# Altium schematic sheet sheet2_sensors.SchDoc
size A4
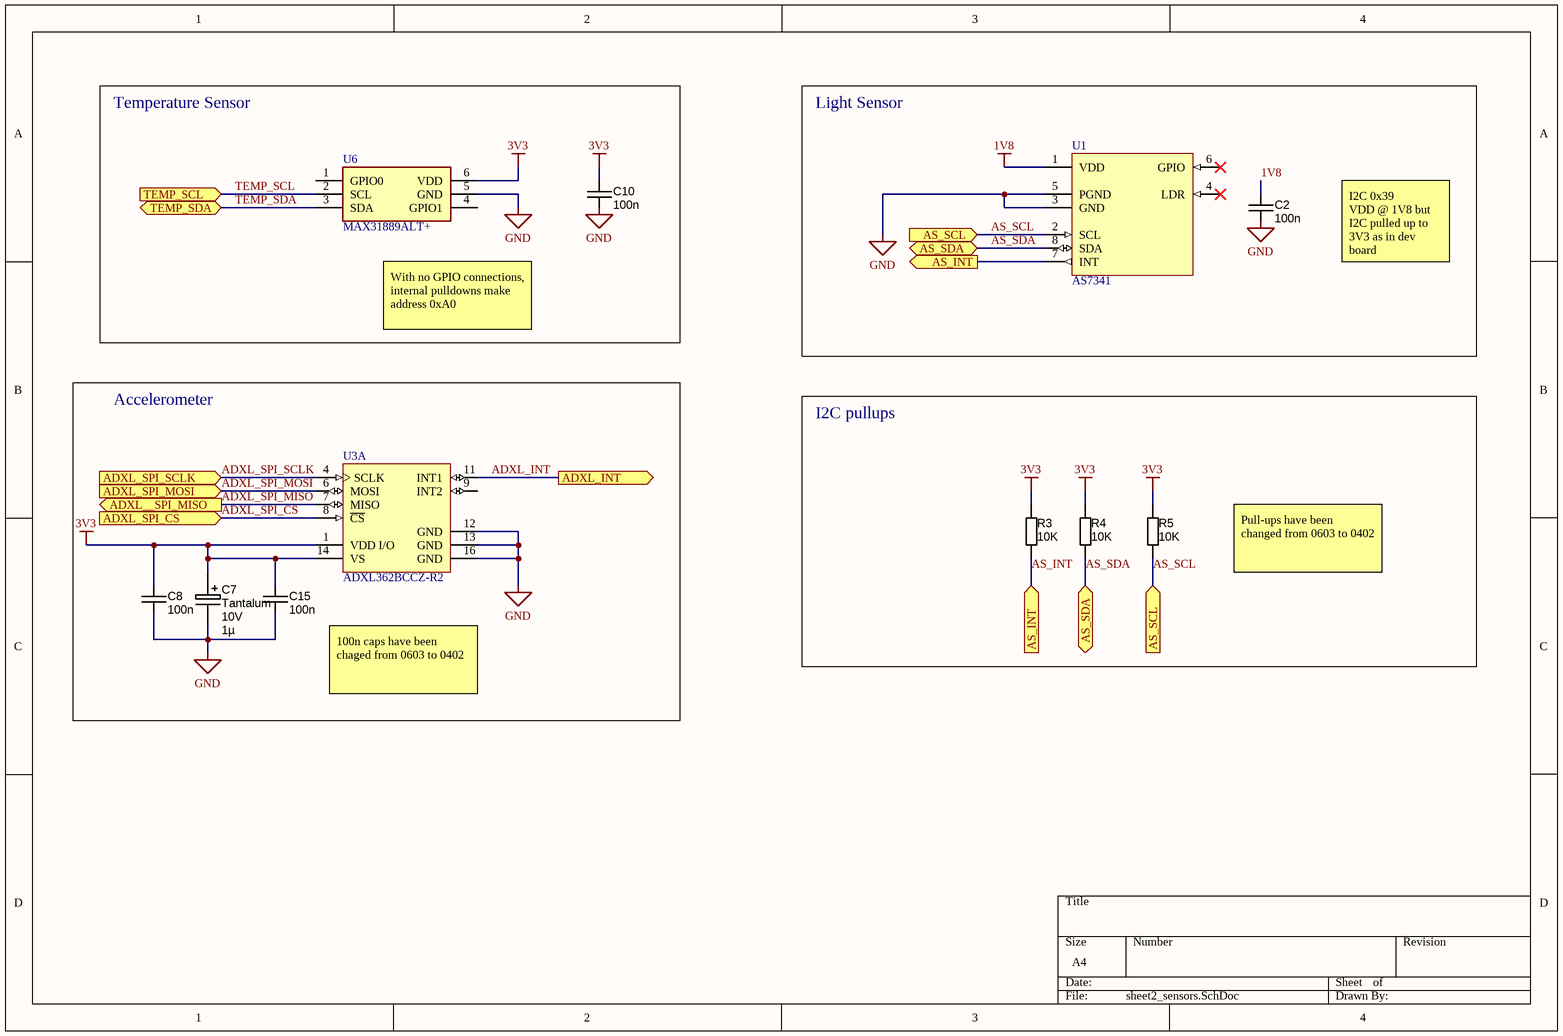
[diagram p0: sheet2_sensors.SchDoc]

## Parts
C2  100n  [CAPC1005X55N]
C7  Material: Tantalum  Ratings: 10V  [CAPMP2012X150USR]  (hidden comment: 1µ)
C8  100n  [CAPC1005X55N]
C10  100n  [CAPC1005X55N]
C15  100n  [CAPC1005X55N]
R3  value 10K  [RESC1005X40N]  (hidden comment: Thick Film)
R4  value 10K  [RESC1005X40N]  (hidden comment: Thick Film)
R5  value 10K  [RESC1005X40N]  (hidden comment: Thick Film)
U1  AS7341  [OLGA8]
U3  ADXL362BCCZ-R2  [ADI-CC-16-4_N]  (part A of 2)
U6  MAX31889ALT+  [MAX31889ALT]

## Blocks framed on the sheet
Temperature Sensor: C10 U6
Light Sensor: C2 U1
Accelerometer: C7 C8 C15 U3
I2C pullups: R3-R5

## Ports
ADXL__SPI_MISO (out), ADXL_INT (out), ADXL_SPI_CS (in), ADXL_SPI_MOSI (in), ADXL_SPI_SCLK (in), AS_INT (in), AS_INT (out), AS_SCL (in), AS_SDA (bidir), TEMP_SCL (in), TEMP_SDA (bidir)

## Nets
1V8: C2.1 U1.1(VDD)
3V3: C7.1 C8.1 C10.1 C15.1 R3.1 R4.1 R5.1 U3.1(VDD_I/O) U3.14(VS) U6.6(VDD)
GND: C2.2 C7.2 C8.2 C10.2 C15.2 U1.3(GND) U1.5(PGND) U3.12(GND) U3.13(GND) U3.16(GND) U6.5(GND)
ADXL_INT: U3.11(INT1) ; port ADXL_INT
ADXL_SPI_CS: U3.8(~{CS}) ; port ADXL_SPI_CS
ADXL_SPI_MISO: U3.7(MISO) ; port ADXL__SPI_MISO
ADXL_SPI_MOSI: U3.6(MOSI) ; port ADXL_SPI_MOSI
ADXL_SPI_SCLK: U3.4(SCLK) ; port ADXL_SPI_SCLK
AS_INT: R3.2 U1.7(INT) ; port AS_INT
AS_SCL: R5.2 U1.2(SCL) ; port AS_SCL
AS_SDA: R4.2 U1.8(SDA) ; port AS_SDA
TEMP_SCL: U6.2(SCL) ; port TEMP_SCL
TEMP_SDA: U6.3(SDA) ; port TEMP_SDA

Not connected (* = marked no-connect by the designer): U1 4(LDR)* 6(GPIO)*; U3 9(INT2); U6 1(GPIO0) 4(GPIO1)

## Notes on the sheet
- I2C 0x39
  VDD @ 1V8 but I2C pulled up to 3V3 as in dev board
- With no GPIO connections, internal pulldowns make address 0xA0
- Pull-ups have been changed from 0603 to 0402
- 100n caps have been chaged from 0603 to 0402

## Library data of the parts
C2 C8 C10 C15 = CAPC_100n_0402_X5R_16V_10%: Capacitor SMD Cer 100nF 10% 16V X5R 0402; Manufacturer 1: AVX Corporation; Manufacturer Part Number 1: 0402YD104KAT2A; Ratings: 16V; X5R; SCDType: spec; Tolerance: ±10%; Operating Temperature: -55°C ~ 125°C; Package / Case: 0402 (1005 Metric); Size / Dimension: 0.039" L x 0.020" W (1.00mm x 0.50mm); Supplier 1: Digi-Key; Supplier Part Number 1: 478-1126-1-ND; ComponentLink1URL: http://www.avx.com/docs/Catalogs/cx5r.pdf; ComponentLink1Description: http://www.avx.com/docs/Catalogs/cx5r.pdf; Supplier 2: Digi-Key; Supplier Part Number 2: 311-1347-1-ND; Manufacturer 2: Yageo; Manufacturer Part Number 2: CC0402KRX5R7BB104; ComponentLink2URL: http://www.yageo.com/documents/recent/UPY-GPHC_X5R_4V-to-50V_12.pdf; ComponentLink2Description: http://www.yageo.com/documents/recent/UPY-GPHC_X5R_4V-to-50V_12.pdf; Value: 100n
C7 = CAPT_1u_0805_10V: Capacitor SMD Tantalum 1uF 20% 10V 0805; Manufacturer 1: AVX Corporation; Manufacturer Part Number 1: TAJP106M010RNJ; Manufacturer Size Code: P; ESR (Equivalent Series Resistance): 6.000 Ohm; Type: Molded; SCDType: spec; Package / Case: 0805 (2012 metric); Tolerance: ±20%; Supplier 1: Digi-Key; Supplier Part Number 1: 478-3281-1-ND; Operating Temperature: -55°C ~ 125°C; Size / Dimension: 0.081" L x 0.053" W (2.05mm x 1.35mm); Height - Seated (Max): 0.059" (1.50mm); ComponentLink1URL: http://www.avx.com/docs/Catalogs/tajlp.pdf; ComponentLink1Description: http://www.avx.com/docs/Catalogs/tajlp.pdf; Value: 1µ
R3-R5 = RES_10K_0402_5%: Resistor SMD chip 10k Ohm 0.063W 5% 0402; Manufacturer 1: Vishay Dale; Manufacturer Part Number 1: CRCW040210K0FKED; Ratings: 1/16 W; SCDType: undef; Package / Case: 0402 (1005 Metric); Tolerance: ±5%; Manufacturer 2: Yageo; Manufacturer Part Number 2: RC0402JR-0710KL; Supplier 1: Digi-Key; Supplier Part Number 1: 541-10.0KLCT-ND; ComponentLink1URL: http://www.vishay.com/doc?20035; ComponentLink1Description: http://www.vishay.com/doc?20035; Supplier 2: Digi-Key; Supplier Part Number 2: 311-10KJRCT-ND; ComponentLink2URL: http://www.yageo.com/documents/recent/PYu-RC0402_51_RoHS_L_6.pdf; ComponentLink2Description: http://www.yageo.com/documents/recent/PYu-RC0402_51_RoHS_L_6.pdf
U1 = AS7341: AMS AS7341 / 11-Channel Spectral Sensor Frontend
U3 = ADXL362BCCZ-R2: Micropower, 3-Axis, +/-2 g / +/-4 g / +/-8 g Digital Output MEMS Accelerometer with 200 Hz BW, Industrial, 16-pin LGA, Reel; Manufacturer: Analog Devices; # of Axes: 3; -3dB Bandwidth: 200 Hz; Sensitivity: 1/2/4 mg/LSB; Supply Current: 1.8 uA; Voltage Supply (V): 1.6 to 3.5; DatasheetVersion: Rev. B; PackageVersion: 10-23-2012-A, 10/2012; PackageReference: CC-16-4; PackageDescription: 16-Pin Land Grid Array, 3.25 x 3 mm Body, 0.5 mm Pitch; Supplier 1: Digi-Key; Supplier Part Number 1: ADXL362BCCZ-R2TR-ND; Supplier 2: Digi-Key; Supplier Part Number 2: ADXL362BCCZ-R2CT-ND; Supplier 3: Digi-Key; Supplier Part Number 3: ADXL362BCCZ-R2DKR-ND; Supplier 4: Newark; Supplier Part Number 4: 45W7058; Supplier 5: Mouser; Supplier Part Number 5: 584-ADXL362BCCZ-R2; Output Type: Digital; Packing: Reel; Mounting Technology: Surface Mount; PartNumber: ADXL362BCCZ-R2; ComponentLink1Description: Manufacturer URL; ComponentLink1URL: http://www.analog.com/en/index.html; ComponentLink2Description: Datasheet; ComponentLink2URL: http://www.analog.com/static/imported-files/data_sheets/ADXL362.pdf; ComponentLink3Description: Package Specification; ComponentLink3URL: http:/www.analog.com/static/imported-files/packages/PKG_PDF/LGA(CC)/CC_16_4.pdf; ComponentLink4Description: Product URL; ComponentLink4URL: http://www.analog.com/en/mems-sensors/mems-inertial-sensors/adxl362/products/product.html
U6 = MAX31889ALT+: Integrated Circuit; Manufacturer_Name: Maxim Integrated; Datasheet Link: https://pdfserv.maximintegrated.com/en/ds/MAX31889.pdf; Height: 0.8mm; Manufacturer_Part_Number: MAX31889ALT+